# EAGLE design MainBoard 10-11 ver.1 (EAGLE 5.10)
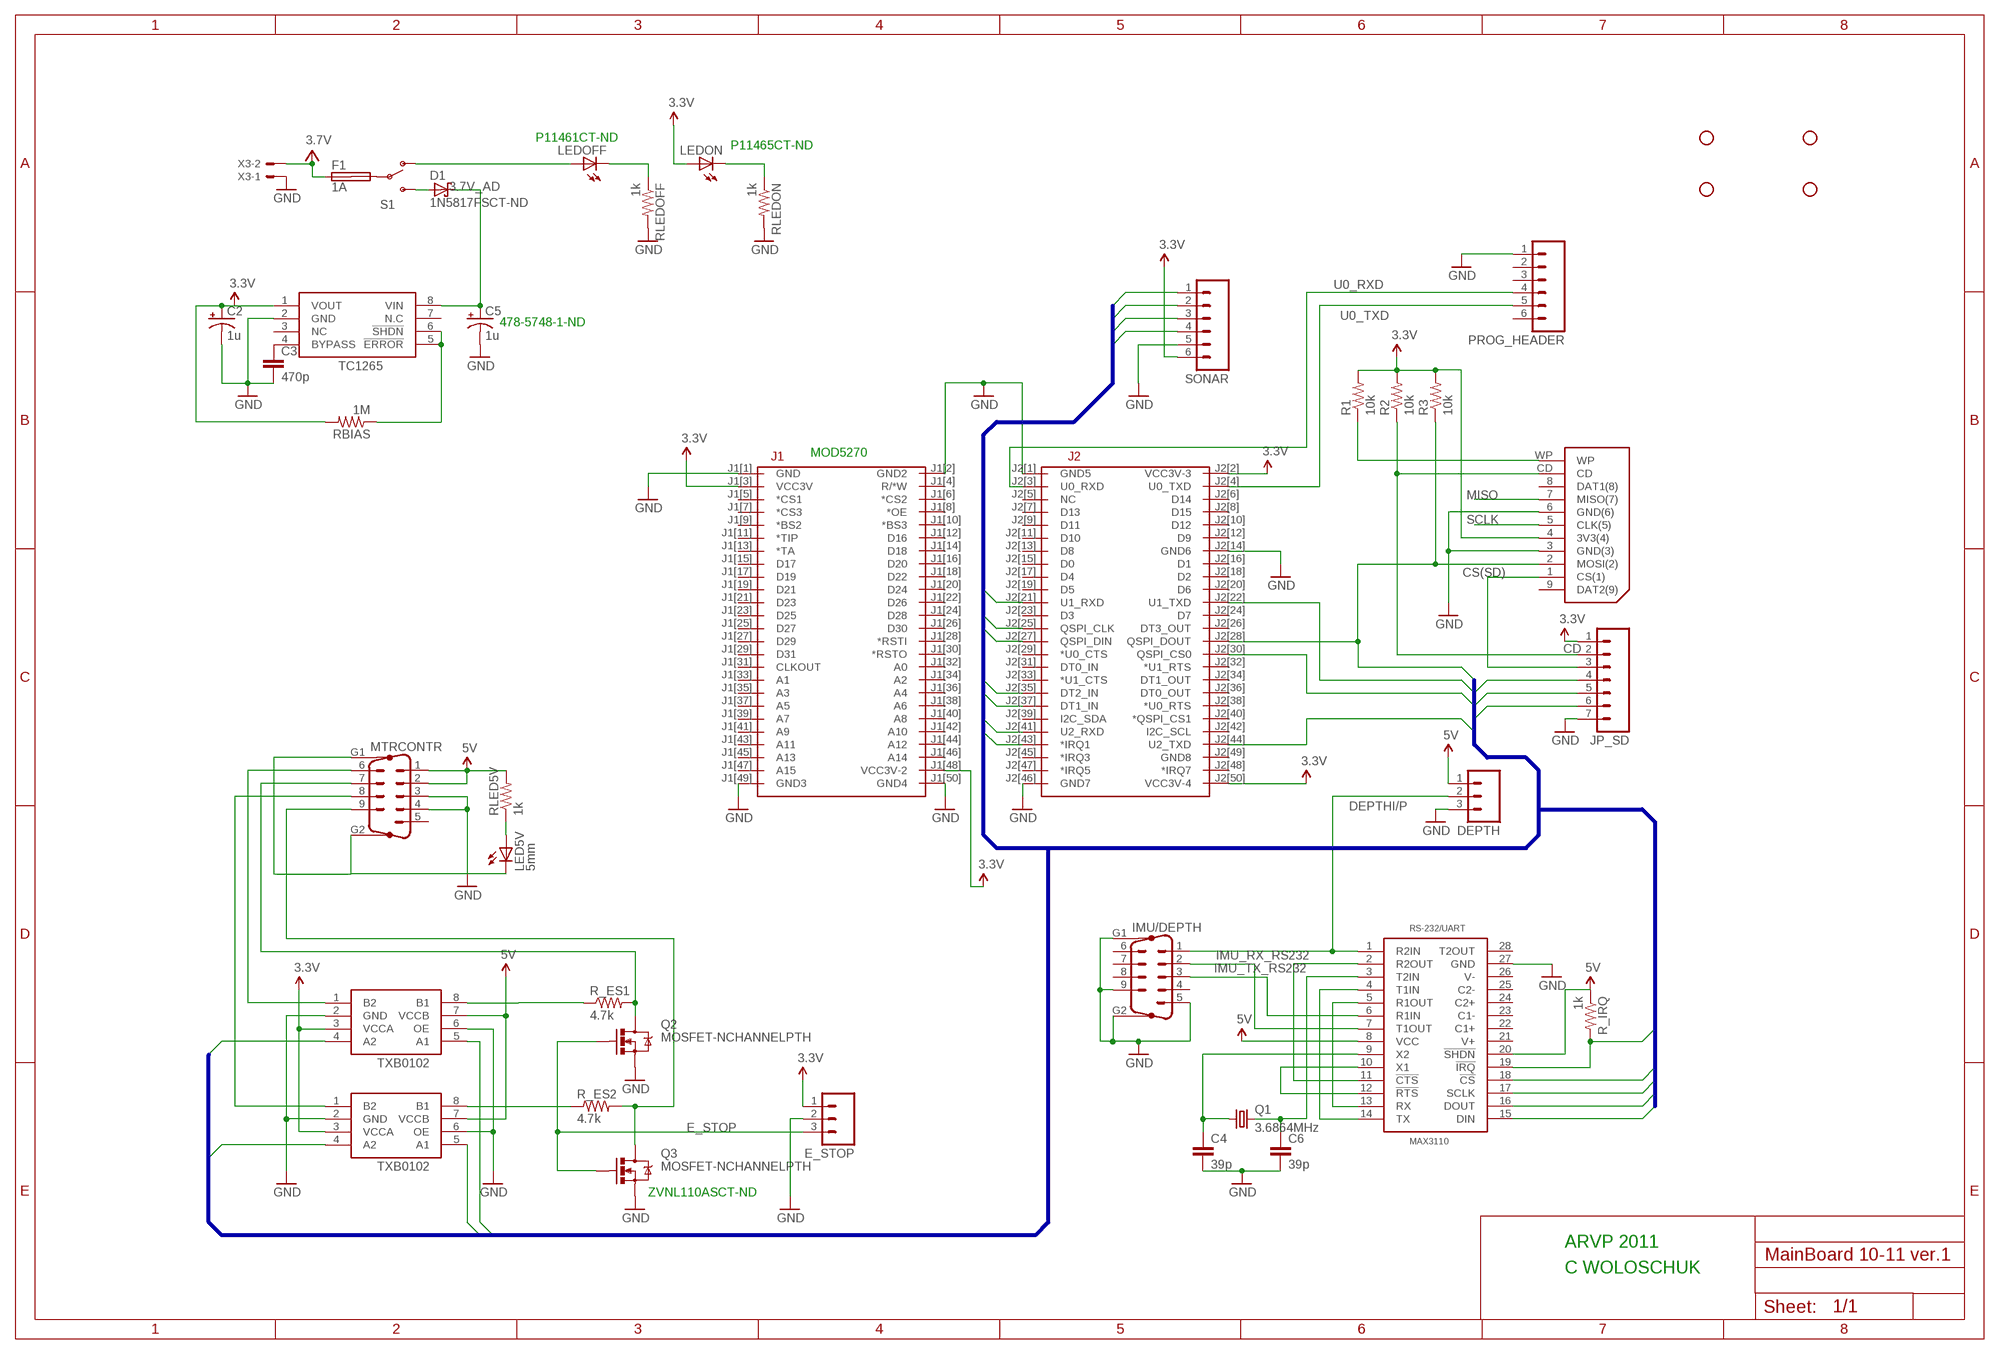
[diagram p0: schematic, sheet 1]

## Parts
C2  1u  CAP_POL1206  [EIA3216]
C3  470p  C-EUC1206  [C1206]
C4  39p  C-EUC1206  [C1206]
C5  1u  CAP_POL1206  [EIA3216]
C6  39p  C-EUC1206  [C1206]
D1  1N5817FSCT-ND  1N5817-B  [DO41-7.6]
DEPTH  M03POLAR  [MOLEX-1X3]
E_STOP  M03POLAR  [MOLEX-1X3]
F1  1A  SHK20L  [SHK20L]
IMU/DEPTH  M09HP  [M09HP]
JP2  STAND-OFF  [STAND-OFF]
JP3  STAND-OFF  [STAND-OFF]
JP4  STAND-OFF  [STAND-OFF]
JP5  STAND-OFF  [STAND-OFF]
JP_SD  M07LOCK  [1X07_LOCK]
LED5V  5mm  LED5MM  [LED5MM]
LEDOFF  LEDCHIP-LED0603  [CHIP-LED0603]
LEDON  LEDCHIP-LED0603  [CHIP-LED0603]
MAX3110  MAX3110  [SO28L]
MOD5270  MOD5270  [MOD5270]
MTRCONTR  M09HP  [M09HP]
PROG_HEADER  M06LOCK_LONGPADS  [1X06_LOCK_LONGPADS]
Q1  3.6864MHz  CRYSTALSM49  [SM49]
Q2  MOSFET-NCHANNELPTH  [TO-92]
Q3  MOSFET-NCHANNELPTH  [TO-92]
R1  10k  RESISTOR1206  [1206]
R2  10k  RESISTOR1206  [1206]
R3  10k  RESISTOR1206  [1206]
R_ES1  4.7k  RESISTOR1206  [1206]
R_ES2  4.7k  RESISTOR1206  [1206]
R_IRQ  1k  RESISTOR1206  [1206]
RBIAS  1M  RESISTOR1206  [1206]
RLED5V  1k  RESISTOR1206  [1206]
RLEDOFF  1k  RESISTOR1206  [1206]
RLEDON  1k  RESISTOR1206  [1206]
S1  SWITCH-SPST  [SWITCH-3PIN-5.47]
SONAR  M06POLAR  [MOLEX-1X6]
TC1265  TC1265  [SO-08]
TXB0101-1  TXB0102  [SOP-08]
TXB0102-2  TXB0102  [SOP-08]
U$2  SD_CARD  [SD_CARD]
X3  KK-156-2  [KK-156-2]

## Nets
3.3V: C2.A(+) E_STOP.1 JP_SD.1 LEDON.A MOD5270.J1[3](VCC3V) MOD5270.J1[48](VCC3V-2) MOD5270.J2[2](VCC3V-3) MOD5270.J2[50](VCC3V-4) R1.2 R2.2 R3.2 RBIAS.2 SONAR.6 TC1265.1(VOUT) TXB0101-1.3(VCCA) TXB0102-2.3(VCCA) U$2.4(3V3(4))
3.7V: F1.1A X3.2
3.7V_AD: C5.A(+) D1.C TC1265.8(VIN)
5V: DEPTH.1 MAX3110.8(VCC) MAX3110.20(!SHDN) MTRCONTR.1 MTRCONTR.2 R_IRQ.1 RLED5V.2 TXB0101-1.7(VCCB) TXB0102-2.7(VCCB)
CD: JP_SD.2 R2.1 U$2.CD
CS(ADC): MOD5270.J2[37](DT1_IN) SONAR.1
CS(MAX3110): MAX3110.18(!CS) MOD5270.J2[30](QSPI_CS0)
CS(SD): JP_SD.3 MOD5270.J2[35](DT2_IN) U$2.1(CS(1))
DEPTHI/P: DEPTH.2 IMU/DEPTH.1 MAX3110.1(R2IN)
E_STOP: E_STOP.3 Q2.3(G) Q3.3(G)
GND: C2.C(-) C3.2 C4.2 C5.C(-) C6.2 DEPTH.3 E_STOP.2 IMU/DEPTH.5 IMU/DEPTH.9 IMU/DEPTH.G1 IMU/DEPTH.G2 JP_SD.7 LED5V.K(C) MAX3110.27(GND) MOD5270.J1[1](GND) MOD5270.J1[2](GND2) MOD5270.J1[49](GND3) MOD5270.J1[50](GND4) MOD5270.J2[1](GND5) MOD5270.J2[14](GND6) MTRCONTR.3 MTRCONTR.4 MTRCONTR.G1 MTRCONTR.G2 PROG_HEADER.1 Q2.2(S) Q3.2(S) RLEDOFF.2 RLEDON.2 SONAR.5 TC1265.2(GND) TXB0101-1.2(GND) TXB0101-1.6(OE) TXB0102-2.2(GND) TXB0102-2.6(OE) U$2.3(GND(3)) U$2.6(GND(6)) X3.1
IMU_RX_RS232: IMU/DEPTH.2 MAX3110.7(T1OUT)
IMU_TX_RS232: IMU/DEPTH.3 MAX3110.6(R1IN)
IRQ1: MAX3110.19(!IRQ) MOD5270.J2[43](*IRQ1) R_IRQ.2
MISO: JP_SD.6 MAX3110.16(DOUT) MOD5270.J2[27](QSPI_DIN) SONAR.3 U$2.7(MISO(7))
MOSI: JP_SD.4 MAX3110.15(DIN) MOD5270.J2[28](QSPI_DOUT) R3.1 SONAR.2 U$2.2(MOSI(2))
N$1: F1.2A S1.P$2(P)
N$2: MAX3110.4(T1IN) MAX3110.14(TX)
N$3: MOD5270.J2[46](GND7) ; supply symbol labelled GND
N$4: R1.1 U$2.WP
N$5: D1.A S1.P$3(S)
N$6: MAX3110.3(T2IN) MAX3110.12(!RTS)
N$7: MAX3110.5(R1OUT) MAX3110.13(RX)
N$8: LEDON.C RLEDON.1
N$9: MAX3110.2(R2OUT) MAX3110.11(!CTS)
N$10: C3.1 TC1265.4(BYPASS)
N$11: LEDOFF.C RLEDOFF.1
N$13: LEDOFF.A S1.P$1(O)
N$14: C6.1 MAX3110.10(X1) Q1.2
N$15: LED5V.A RLED5V.1
N$16: RBIAS.1 TC1265.5(!ERROR) TC1265.6(!SHDN)
N$17: C4.1 MAX3110.9(X2) Q1.1
S1-1: MTRCONTR.6 TXB0101-1.1(B2)
S1-2: MTRCONTR.8 TXB0102-2.1(B2)
S2-1: R_ES1.1 TXB0101-1.8(B1)
S2-1-ES: MTRCONTR.7 Q2.1(D) R_ES1.2
S2-2: R_ES2.1 TXB0102-2.8(B1)
S2-2-ES: MTRCONTR.9 Q3.1(D) R_ES2.2
SCLK: JP_SD.5 MAX3110.17(SCLK) MOD5270.J2[25](QSPI_CLK) SONAR.4 U$2.5(CLK(5))
U0_RXD: MOD5270.J2[3](U0_RXD) PROG_HEADER.4
U0_TXD: MOD5270.J2[4](U0_TXD) PROG_HEADER.5
U1_MCRX: MOD5270.J2[21](U1_RXD) TXB0101-1.5(A1)
U1_MCTX: MOD5270.J2[22](U1_TXD) TXB0101-1.4(A2)
U2_MCRX: MOD5270.J2[41](U2_RXD) TXB0102-2.5(A1)
U2_MCTX: MOD5270.J2[44](U2_TXD) TXB0102-2.4(A2)
Unconnected: F1.1B F1.2B IMU/DEPTH.4 IMU/DEPTH.6 IMU/DEPTH.7 IMU/DEPTH.8 MAX3110.21(V+) MAX3110.22(C1+) MAX3110.23(C1-) MAX3110.24(C2+) MAX3110.25(C2-) MAX3110.26(V-) MAX3110.28(T2OUT) MOD5270.J1[4](R/*W) MOD5270.J1[5](*CS1) MOD5270.J1[6](*CS2) MOD5270.J1[7](*CS3) MOD5270.J1[8](*OE) MOD5270.J1[9](*BS2) MOD5270.J1[10](*BS3) MOD5270.J1[11](*TIP) MOD5270.J1[12](D16) MOD5270.J1[13](*TA) MOD5270.J1[14](D18) MOD5270.J1[15](D17) MOD5270.J1[16](D20) MOD5270.J1[17](D19) MOD5270.J1[18](D22) MOD5270.J1[19](D21) MOD5270.J1[20](D24) MOD5270.J1[21](D23) MOD5270.J1[22](D26) MOD5270.J1[23](D25) MOD5270.J1[24](D28) MOD5270.J1[25](D27) MOD5270.J1[26](D30) MOD5270.J1[27](D29) MOD5270.J1[28](*RSTI) MOD5270.J1[29](D31) MOD5270.J1[30](*RSTO) MOD5270.J1[31](CLKOUT) MOD5270.J1[32](A0) MOD5270.J1[33](A1) MOD5270.J1[34](A2) MOD5270.J1[35](A3) MOD5270.J1[36](A4) MOD5270.J1[37](A5) MOD5270.J1[38](A6) MOD5270.J1[39](A7) MOD5270.J1[40](A8) MOD5270.J1[41](A9) MOD5270.J1[42](A10) MOD5270.J1[43](A11) MOD5270.J1[44](A12) MOD5270.J1[45](A13) MOD5270.J1[46](A14) MOD5270.J1[47](A15) MOD5270.J2[5](NC) MOD5270.J2[6](D14) MOD5270.J2[7](D13) MOD5270.J2[8](D15) MOD5270.J2[9](D11) MOD5270.J2[10](D12) MOD5270.J2[11](D10) MOD5270.J2[12](D9) MOD5270.J2[13](D8) MOD5270.J2[15](D0) MOD5270.J2[16](D1) MOD5270.J2[17](D4) MOD5270.J2[18](D2) MOD5270.J2[19](D5) MOD5270.J2[20](D6) MOD5270.J2[23](D3) MOD5270.J2[24](D7) MOD5270.J2[26](DT3_OUT) MOD5270.J2[29](*U0_CTS) MOD5270.J2[31](DT0_IN) MOD5270.J2[32](*U1_RTS) MOD5270.J2[33](*U1_CTS) MOD5270.J2[34](DT1_OUT) MOD5270.J2[36](DT0_OUT) MOD5270.J2[38](*U0_RTS) MOD5270.J2[39](I2C_SDA) MOD5270.J2[40](*QSPI_CS1) MOD5270.J2[42](I2C_SCL) MOD5270.J2[45](*IRQ3) MOD5270.J2[47](*IRQ5) MOD5270.J2[48](*IRQ7) MOD5270.J2[49](GND8) MTRCONTR.5 PROG_HEADER.2 PROG_HEADER.3 PROG_HEADER.6 TC1265.3(NC) TC1265.7(N.C) U$2.8(DAT1(8)) U$2.9(DAT2(9))

## Buses
U1_MCRX,U2_MCRX,SCLK,MISO,MOSI,CS(SD),CS(ADC),IRQ1,U1_MCTX,U2_MCTX,CS(MAX3110)

## Notes on the sheet
- P11461CT-ND
- P11465CT-ND
- 478-5748-1-ND
- MOD5270
- ZVNL110ASCT-ND
- ARVP 2011
- C WOLOSCHUK

## Library data of the parts
C2 C5 = SparkFun:CAP_POL: Capacitor Polarized These are standard SMD and PTH capacitors. Normally 10uF, 47uF, and 100uF in electrolytic and tantalum varieties. Always verify the external diameter of the through hole cap, it varies with capacity, voltage, and manufacturer. The EIA devices should be standard.
C3 C4 C6 = rcl:C-EU: CAPACITOR, European symbol
D1 = diode:1N581*: 1.0A SCHOTTKY BARRIER RECTIFIER Source: http://www.diodes.com/datasheets/ds23001.pdf
DEPTH E_STOP = SparkFun:M03: Header 3 Standard 3-pin 0.1" header. Use with straight break away headers (SKU : PRT-00116), right angle break away headers (PRT-00553), swiss pins (PRT-00743), machine pins (PRT-00117), and female headers (PRT-00115). Molex polarized connector foot print use with SKU : PRT-08232 with associated crimp pins and housings.
F1 = fuse:SHK20L: FUSE HOLDER 5 x 20 mm, SH contact, SHH1 Schukat, E1073 Buerklin
IMU/DEPTH MTRCONTR = con-subd:M09HP: SUB-D
JP2-JP5 = SparkFun:STAND-OFF: Stand Off This is the mechanical footprint for a #4 phillips button head screw. Use the keepout ring to avoid running the screw head into surrounding components. SKU : PRT-00447
JP_SD = SparkFun:M07: Header 7 Standard 7-pin 0.1" header. Use with straight break away headers (SKU : PRT-00116), right angle break away headers (PRT-00553), swiss pins (PRT-00743), machine pins (PRT-00117), and female headers (PRT-00115). NOTES ON THE VARIANTS LOCK and LOCK_LONGPADS... This footprint was designed to help hold the alignment of a through-hole component (i.e. 7-pin header) while soldering it into place. You may notice that each hole has been shifted either up or down by 0.005 of an inch from it's more standard position (which is usually a perfectly straight line). This slight alteration caused the pins (the squares in the middle) to touch the edges of the holes. Because they are alternating, it causes a "brace" to hold the header in place. 0.005 has proven to be the perfect amount of "off-center" position when using our standard breakaway headers. Although looks a little odd when you look at the bare footprint, once you have a header in there, the alteration is very hard to notice. Also, if you push a header all the way into place, it is covered up entirely on the bottom side. This idea of altering the position of holes to aid alignment will be further integrated into the Sparkfun Library for other footprints. It can help hold any component with 3 or more connection pins.
LED5V = SparkFun:LED: LEDs Standard schematic elements and footprints for 5mm, 3mm, 1206, and 0603 sized LEDs. 5mm - Spark Fun Electronics SKU : COM-00529 (and others)
LEDOFF LEDON = led:LED: LED OSRAM: - CHIPLED LG R971, LG N971, LY N971, LG Q971, LY Q971, LO R971, LY R971 LH N974, LH R974 LS Q976, LO Q976, LY Q976 LO Q996 - Hyper CHIPLED LW Q18S LB Q993, LB Q99A, LB R99A - SideLED LS A670, LO A670, LY A670, LG A670, LP A670 LB A673, LV A673, LT A673, LW A673 LH A674 LY A675 LS A676, LA A676, LO A676, LY A676, LW A676 LS A679, LY A679, LG A679 - Hyper Micro SIDELED® LS Y876, LA Y876, LO Y876, LY Y876 LT Y87S - SmartLED LW L88C, LW L88S LB L89C, LB L89S, LG L890 LS L89K, LO L89K, LY L89K LS L896, LA L896, LO L896, LY L896 - TOPLED LS T670, LO T670, LY T670, LG T670, LP T670 LSG T670, LSP T670, LSY T670, LOP T670, LYG T670 LG T671, LOG T671, LSG T671 LB T673, LV T673, LT T673, LW T673 LH T674 LS T676, LA T676, LO T676, LY T676, LB T676, LH T676, LSB T676, LW T676 LB T67C, LV T67C, LT T67C, LS T67K, LO T67K, LY T67K, LW E67C LS E67B, LA E67B, LO E67B, LY E67B, LB E67C, LV E67C, LT E67C LW T67C LS T679, LY T679, LG T679 LS T770, LO T770, LY T770, LG T770, LP T770 LB T773, LV T773, LT T773, LW T773 LH T774 LS E675, LA E675, LY E675, LS T675 LS T776, LA T776, LO T776, LY T776, LB T776 LHGB T686 LT T68C, LB T68C - Hyper Mini TOPLED® LB M676 - Mini TOPLED Santana® LG M470 LS M47K, LO M47K, LY M47K Source: http://www.osram.convergy.de LUXEON: - LUMILED® LXK2-PW12-R00, LXK2-PW12-S00, LXK2-PW14-U00, LXK2-PW14-V00 LXK2-PM12-R00, LXK2-PM12-S00, LXK2-PM14-U00 LXK2-PE12-Q00, LXK2-PE12-R00, LXK2-PE12-S00, LXK2-PE14-T00, LXK2-PE14-U00 LXK2-PB12-K00, LXK2-PB12-L00, LXK2-PB12-M00, LXK2-PB14-N00, LXK2-PB14-P00, LXK2-PB14-Q00 LXK2-PR12-L00, LXK2-PR12-M00, LXK2-PR14-Q00, LXK2-PR14-R00 LXK2-PD12-Q00, LXK2-PD12-R00, LXK2-PD12-S00 LXK2-PH12-R00, LXK2-PH12-S00 LXK2-PL12-P00, LXK2-PL12-Q00, LXK2-PL12-R00 Source: www.luxeon.com KINGBRIGHT: KA-3528ASYC Source: www.kingbright.com
MAX3110 = ARVP:MAX3110
MOD5270 = ARVP:MOD5270: Coldfire MOD5270 Microcontroller footprint
PROG_HEADER SONAR = SparkFun:M06: Header 6 Standard 6-pin 0.1" header. Use with straight break away headers (SKU : PRT-00116), right angle break away headers (PRT-00553), swiss pins (PRT-00743), machine pins (PRT-00117), and female headers (PRT-00115). Molex polarized connector foot print use with SKU : PRT-08094 with associated crimp pins and housings. NOTES ON THE VARIANTS LOCK and LOCK_LONGPADS... This footprint was designed to help hold the alignment of a through-hole component (i.e. 6-pin header) while soldering it into place. You may notice that each hole has been shifted either up or down by 0.005 of an inch from it's more standard position (which is a perfectly straight line). This slight alteration caused the pins (the squares in the middle) to touch the edges of the holes. Because they are alternating, it causes a "brace" to hold the component in place. 0.005 has proven to be the perfect amount of "off-center" position when using our standard breakaway headers. Although looks a little odd when you look at the bare footprint, once you have a header in there, the alteration is very hard to notice. Also, if you push a header all the way into place, it is covered up entirely on the bottom side. This idea of altering the position of holes to aid alignment will be further integrated into the Sparkfun Library for other footprints. It can help hold any component with 3 or more connection pins.
Q1 = crystal:CRYSTAL: CRYSTAL
Q2 Q3 = SparkFun:MOSFET-NCHANNEL
R1-R3 R_ES1 R_ES2 R_IRQ RBIAS RLED5V RLEDOFF RLEDON = SparkFun:RESISTOR: Resistor Basic schematic elements and footprints for 0603, 1206, and PTH 1/10th watt (small) resistors.
S1 = ARVP:SWITCH-SPST: SPST Switch Simple slide switch. Spark Fun Electronics SKU : COM-00102
TC1265 = ARVP:TC1265
TXB0101-1 TXB0102-2 = ARVP:TXB0102
U$2 = ARVP:SD_CARD
X3 = con-molex:KK-156-2: KK 156 HEADER Source: http://www.molex.com/pdm_docs/sd/026604100_sd.pdf

## Board
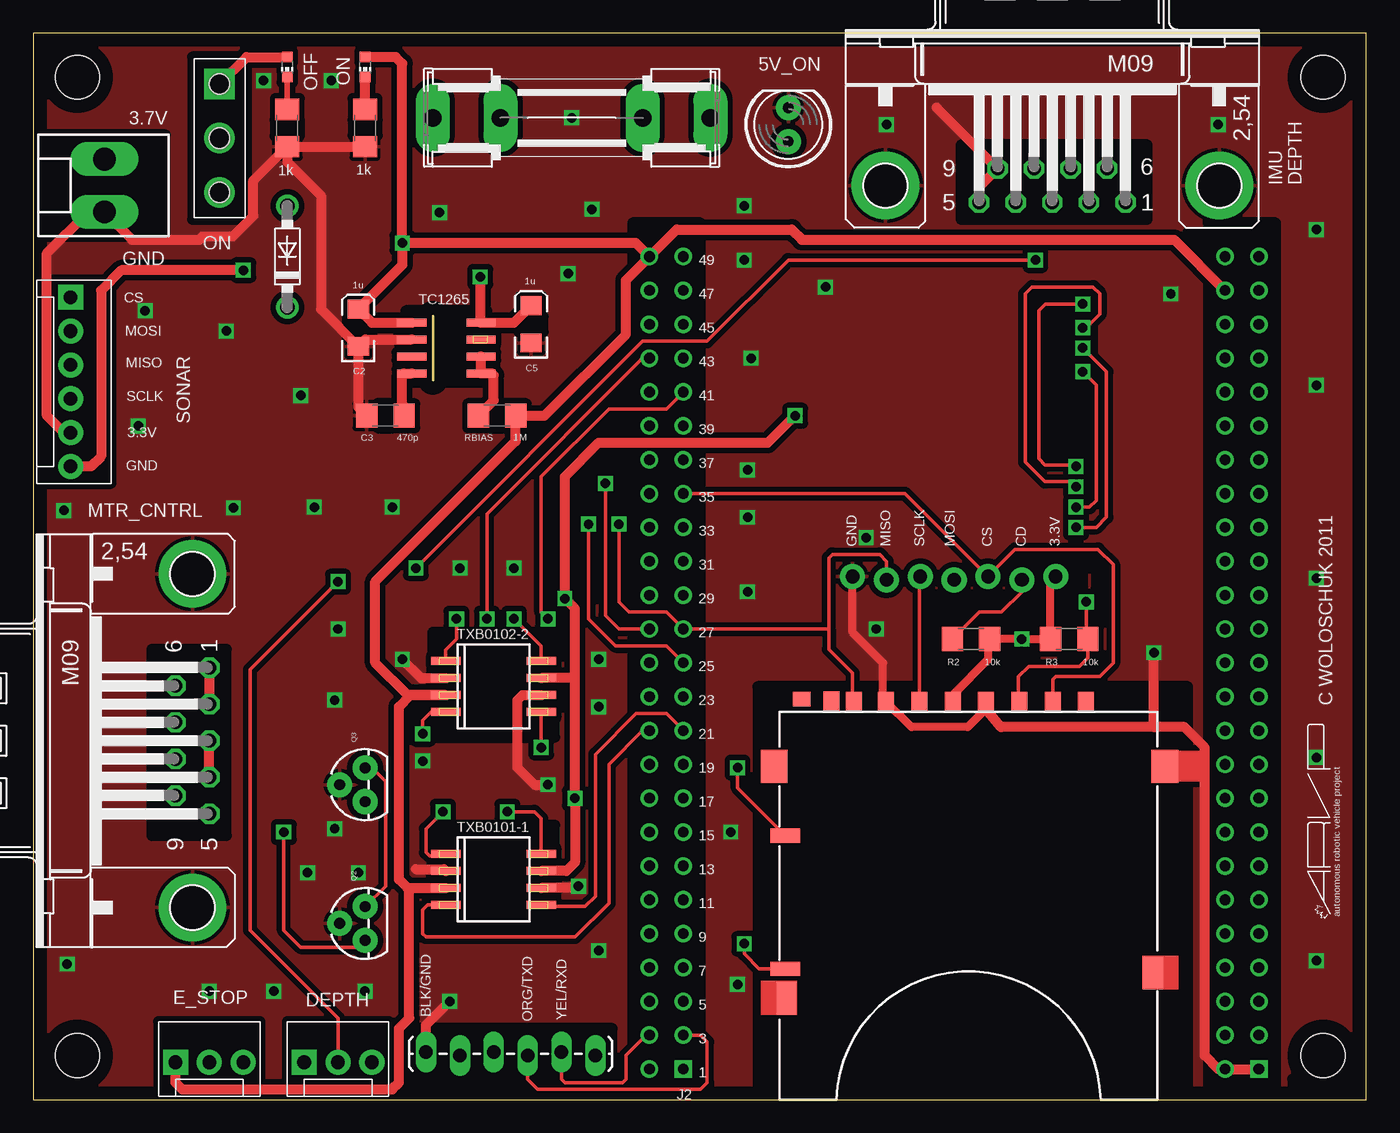
[diagram p1: board, top side]
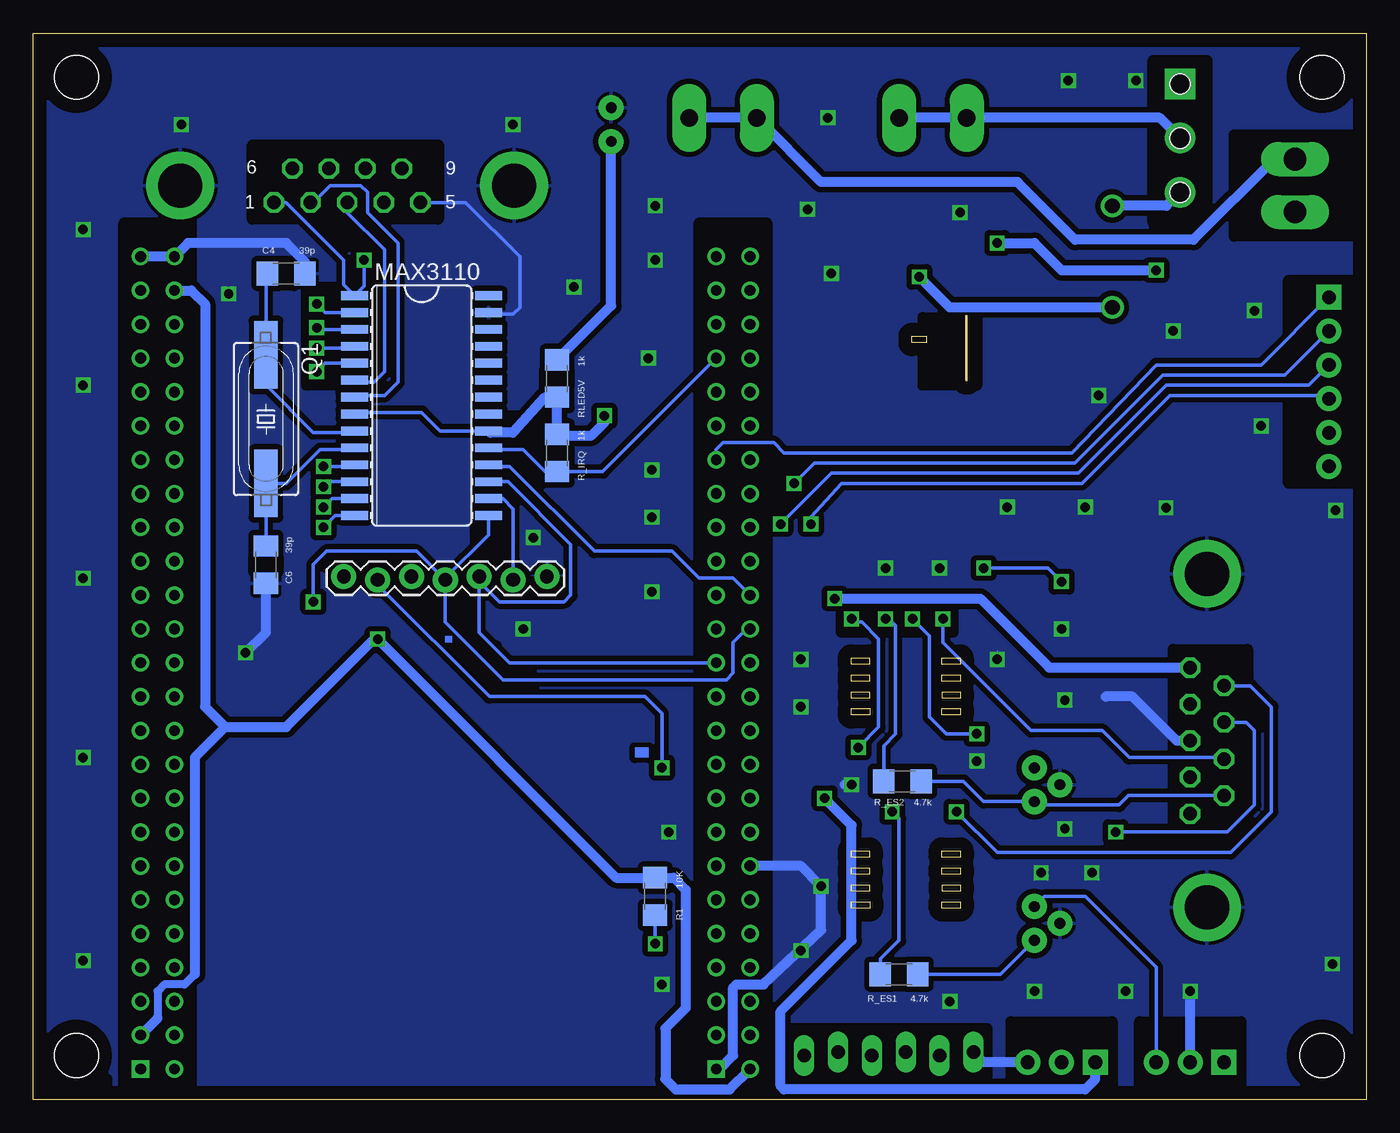
[diagram p2: board, bottom side, seen from below]

Size 100 x 80 mm. Coordinates in mm from the lower left corner, seen from the top.
Outline: 0,0 100,0 100,80 0,80 0,0
Copper layers (1*16): Top 0.035mm / dielectric 1.5mm / Bottom 0.035mm
Design rules "default *": minimum track width 10mil, minimum drill 28mil, track to track 8mil, track to pad 8mil, pad to pad 8mil, via to via 8mil, smd to smd 8mil, copper to edge 40mil, drill to drill 8mil, minimum pad ring 10mil, minimum via ring 8mil, stop-mask expansion 4mil, vias tented up to drill 28mil, thermal gap 10mil
tRestrict: area 30,12.7 to 39.1,20.6; area 30,27.2 to 39.1,35.1; area 0.3,46.2 to 5.8,61.5; area 9.4,0.3 to 17,5.8; area 19,0.3 to 26.7,5.8; area 28.7,1.8 to 43.4,5.3; area 11.9,66 to 16,78.2; area 0,64.8 to 9.9,72.4; area 69.6,66 to 83.6,71.6; area 8.9,19.8 to 14.5,33.8; area 45,0 to 50,65.8; area 88.1,0 to 93.2,65.8; 50 more areas
bRestrict: area 0.3,46.2 to 5.8,61.5; area 9.4,0.3 to 17,5.8; area 19,0.3 to 26.7,5.8; area 28.4,1.8 to 43.2,5.3; area 11.9,65.8 to 16,78; area 0,64.8 to 9.9,72.4; area 69.6,66 to 83.6,71.6; area 8.9,19.8 to 14.5,33.8; area 45,0 to 50,65.8; area 88.1,0 to 93.2,65.8; area 61.7,46.2 to 64.3,51.3; area 5.8,54.1 to 7.1,55.6; 33 more areas

### Footprints (pad centres in the part's own frame; a part is rotated, then mirrored left to right if it is on the bottom)
EIA3216 = smd 1.4 x 1.6: A 1.4,0; C -1.4,0
C1206 = smd 1.6 x 1.8: 1 -1.4,0; 2 1.4,0
DO41-7.6 = drill 1.1 pad 1.7 round: A 3.81,0; C -3.81,0
MOLEX-1X3 = drill 1.016 pad 1.88 square: 1 0,0 | drill 1.016 pad 1.88 round: 2 2.54,0; 3 5.08,0
SHK20L = drill 1.321 pad 2.54 long: 1A -10.414,0; 1B -5.334,0; 2A 10.414,0; 2B 5.334,0
M09HP = drill 1.016 octagon: 1 -5.486,1.27; 2 -2.743,1.27; 3 0,1.27; 4 2.743,1.27; 5 5.486,1.27; 6 -4.115,-1.27; 7 -1.372,-1.27; 8 1.372,-1.27; 9 4.115,-1.27 | drill 3.302 pad 5.08 round: G1 -12.522,0; G2 12.522,0
STAND-OFF = hole 3.302: 0,0
1X07_LOCK = drill 1.016 pad 1.88 round: 1 0,0.127; 2 2.54,-0.127; 3 5.08,0.127; 4 7.62,-0.127; 5 10.16,0.127; 6 12.7,-0.127; 7 15.24,0.127
LED5MM = drill 0.813 pad 1.88 round: A -1.27,0; K 1.27,0
CHIP-LED0603 = smd 0.8 x 0.8: A 0,-0.75; C 0,0.75
SO28L = smd 0.66 x 2.032: 1 -8.255,-5.029; 2 -6.985,-5.029; 3 -5.715,-5.029; 4 -4.445,-5.029; 5 -3.175,-5.029; 6 -1.905,-5.029; 7 -0.635,-5.029; 8 0.635,-5.029; 9 1.905,-5.029; 10 3.175,-5.029; 11 4.445,-5.029; 12 5.715,-5.029; 13 6.985,-5.029; 14 8.255,-5.029; 15 8.255,5.029; 16 6.985,5.029; 17 5.715,5.029; 18 4.445,5.029; 19 3.175,5.029; 20 1.905,5.029; 21 0.635,5.029; 22 -0.635,5.029; 23 -1.905,5.029; 24 -3.175,5.029; 25 -4.445,5.029; 26 -5.715,5.029; 27 -6.985,5.029; 28 -8.255,5.029
MOD5270 = drill 0.8 square: J1[1] -23.368,35.052; J2[1] 19.812,35.052 | drill 0.8 round: J1[2] -20.828,35.052; J1[3] -23.368,32.512; J1[4] -20.828,32.512; J1[5] -23.368,29.972; J1[6] -20.828,29.972; J1[7] -23.368,27.432; J1[8] -20.828,27.432; J1[9] -23.368,24.892; J1[10] -20.828,24.892; J1[11] -23.368,22.352; J1[12] -20.828,22.352; J1[13] -23.368,19.812; J1[14] -20.828,19.812; J1[15] -23.368,17.272; J1[16] -20.828,17.272; J1[17] -23.368,14.732; J1[18] -20.828,14.732; J1[19] -23.368,12.192; J1[20] -20.828,12.192; J1[21] -23.368,9.652; J1[22] -20.828,9.652; J1[23] -23.368,7.112; J1[24] -20.828,7.112; J1[25] -23.368,4.572; J1[26] -20.828,4.572; J1[27] -23.368,2.032; J1[28] -20.828,2.032; J1[29] -23.368,-0.508; J1[30] -20.828,-0.508; J1[31] -23.368,-3.048; J1[32] -20.828,-3.048; J1[33] -23.368,-5.588; J1[34] -20.828,-5.588; J1[35] -23.368,-8.128; J1[36] -20.828,-8.128; J1[37] -23.368,-10.668; J1[38] -20.828,-10.668; J1[39] -23.368,-13.208; J1[40] -20.828,-13.208; J1[41] -23.368,-15.748; J1[42] -20.828,-15.748; J1[43] -23.368,-18.288; J1[44] -20.828,-18.288; J1[45] -23.368,-20.828; J1[46] -20.828,-20.828; J1[47] -23.368,-23.368; J1[48] -20.828,-23.368; J1[49] -23.368,-25.908; J1[50] -20.828,-25.908; J2[2] 22.352,35.052; J2[3] 19.812,32.512; J2[4] 22.352,32.512; J2[5] 19.812,29.972; J2[6] 22.352,29.972; J2[7] 19.812,27.432; J2[8] 22.352,27.432; J2[9] 19.812,24.892; J2[10] 22.352,24.892; J2[11] 19.812,22.352; J2[12] 22.352,22.352; J2[13] 19.812,19.812; J2[14] 22.352,19.812; J2[15] 19.812,17.272; J2[16] 22.352,17.272; J2[17] 19.812,14.732; J2[18] 22.352,14.732; J2[19] 19.812,12.192; J2[20] 22.352,12.192; J2[21] 19.812,9.652; J2[22] 22.352,9.652; J2[23] 19.812,7.112; J2[24] 22.352,7.112; J2[25] 19.812,4.572; J2[26] 22.352,4.572; J2[27] 19.812,2.032; J2[28] 22.352,2.032; J2[29] 19.812,-0.508; J2[30] 22.352,-0.508; J2[31] 19.812,-3.048; J2[32] 22.352,-3.048; J2[33] 19.812,-5.588; J2[34] 22.352,-5.588; J2[35] 19.812,-8.128; J2[36] 22.352,-8.128; J2[37] 19.812,-10.668; J2[38] 22.352,-10.668; J2[39] 19.812,-13.208; J2[40] 22.352,-13.208; J2[41] 19.812,-15.748; J2[42] 22.352,-15.748; J2[43] 19.812,-18.288; J2[44] 22.352,-18.288; J2[45] 19.812,-20.828; J2[46] 22.352,-20.828; J2[47] 19.812,-23.368; J2[48] 22.352,-23.368; J2[49] 19.812,-25.908; J2[50] 22.352,-25.908
1X06_LOCK_LONGPADS = drill 1.016 long: 1 0,0; 2 2.54,-0.254; 3 5.08,0; 4 7.62,-0.254; 5 10.16,0; 6 12.7,-0.254
SM49 = smd 5.08 x 1.778: 1 -4.826,0; 2 4.826,0
TO-92 = drill 0.813 pad 1.88 round: 1 -1.27,0; 2 0,1.905; 3 1.27,0
1206 = smd 1.6 x 1.8: 1 -1.4,0; 2 1.4,0
SWITCH-3PIN-5.47 = drill 1.524 square: P$1 0,0 | drill 1.524 round: P$2 0,-4.064; P$3 0,-8.128 | hole 1.524: 0,0; 0,-4.064; 0,-8.128
MOLEX-1X6 = drill 1.016 pad 1.88 square: 1 0,0 | drill 1.016 pad 1.88 round: 2 2.54,0; 3 5.08,0; 4 7.62,0; 5 10.16,0; 6 12.7,0
SO-08 = smd 0.6 x 2.2: 1 -1.905,-2.6; 2 -0.635,-2.6; 3 0.635,-2.6; 4 1.905,-2.6; 5 1.905,2.6; 6 0.635,2.6; 7 -0.635,2.6; 8 -1.905,2.6
SOP-08 = smd 0.6 x 2.2: 1 -1.905,-3.6; 2 -0.635,-3.6; 3 0.635,-3.6; 4 1.905,-3.6; 5 1.905,3.575; 6 0.635,3.575; 7 -0.635,3.575; 8 -1.905,3.575
SD_CARD = smd 1.2 x 1.5: 1 6.88,12.07; 2 4.38,12.07; 3 1.88,12.07; 4 -0.62,12.07; 5 -3.12,12.07; 6 -5.62,12.07; 7 -8.04,12.07; 8 -9.728,12.09; 9 9.38,12.07 | smd 1.5 x 2.5: 12 -13.1,-10.18; 13 14.402,-8.255 | smd 2 x 2.5: 14 -14,7.22; 15 15.3,7.22 | smd 2.184 x 1.067: CD -13.18,2.02; WP -13.18,-7.98 | smd 1.3 x 1.1: SW -11.938,12.268
KK-156-2 = drill 1.7 pad 2.184 long: 1 -1.98,0; 2 1.98,0

### Placement (x,y rotation side)
C2  24.38,57.91 90 top
C3  26.42,51.31 180 top
C4  81.03,61.98 0 bottom
C5  37.34,58.17 90 top
C6  82.55,40.13 270 bottom
D1  19.05,63.25 90 top
DEPTH  20.32,2.79 0 top
E_STOP  10.67,2.79 0 top
F1  40.39,73.66 180 top
IMU/DEPTH  76.45,68.58 180 top
JP2  96.77,76.71 0 top
JP3  3.3,76.71 0 top
JP4  3.3,3.3 0 top
JP5  96.77,3.3 0 top
JP_SD  76.71,39.12 0 bottom
LED5V  56.64,73.15 90 top
LEDOFF  19.05,77.47 180 top
LEDON  24.89,77.47 180 top
MAX3110  70.87,52.07 270 bottom
MOD5270  68.58,37.34 180 top
MTRCONTR  11.94,26.92 270 top
PROG_HEADER  29.46,3.56 0 top
Q1  82.55,51.05 270 bottom
Q2  24.89,13.21 90 top
Q3  24.89,23.62 90 top
R1  53.34,15.24 90 bottom
R2  70.36,34.54 0 top
R3  77.72,34.54 180 top
R_ES1  35.05,9.4 0 bottom
R_ES2  34.8,23.88 0 bottom
R_IRQ  60.71,48.51 270 bottom
RBIAS  34.8,51.31 0 top
RLED5V  60.71,54.1 270 bottom
RLEDOFF  19.05,72.9 270 top
RLEDON  24.89,72.9 270 top
S1  13.97,76.2 0 top
SONAR  2.79,60.2 270 top
TC1265  30.99,56.39 270 top
TXB0101-1  34.54,16.51 270 top
TXB0102-2  34.54,30.99 270 top
U$1  [ARVP]  98.04,13.72 90 top
U$2  69.6,17.78 0 top
X3  5.33,68.58 90 top

### Tracks (layer width: path | path; a pad name or v marks a point on that pad's centre or on a via)
3.3V  (via drill 0.71)
  Top 0.254: 68.98,30.37 U$2.4 | R2.2 71.63,34.41
  Top 0.61: 76.32,38.86 R3.2 v74.17,34.54 R2.2 | 68.98,30.37 71.63,33.02 71.63,34.41
  Top 0.762: TC1265.1 25.4,58.29 C2.A 27.69,62.61 v27.69,64.26 | v15.75,62.23 6.6,62.23 5.08,60.71 5.08,48.26 4.32,47.5 SONAR.6 | LEDON.A 27.19,78.22 27.69,77.72 v27.69,64.26 | 76.32,38.86 JP_SD.1 | v27.69,64.26 45.21,64.26 MOD5270.J2[50] | 28.07,15.88 27.43,16.51 27.43,29.46 28.32,30.35 TXB0102-2.3 28.07,30.35 25.65,32.77 25.65,38.86 36.2,49.41 RBIAS.2 38.35,51.31 44.45,57.4 44.45,61.47 MOD5270.J2[50] | 28.07,15.88 TXB0101-1.3 | 28.07,15.88 28.19,15.75 28.19,6.1 27.43,5.33 27.43,1.27 26.92,0.76 11.18,0.76 10.67,1.27 E_STOP.1 | MOD5270.J2[50] 48.26,65.28 56.9,65.28 57.66,64.52 85.6,64.52 MOD5270.J1[48]
  Bottom 0.61: 90.68,6.1 90.68,8.13 90.17,8.64 88.65,8.64 87.88,9.4
  Bottom 0.762: v15.75,62.23 22.86,62.23 24.89,64.26 v27.69,64.26 | 90.68,6.1 MOD5270.J1[3] | 87.88,9.4 87.88,25.65 85.6,27.94 | 85.6,27.94 81.03,27.94 74.42,34.54 v74.17,34.54 56.26,16.64 R1.2 51.95,16.64 51.05,15.75 51.05,6.86 52.58,5.33 52.58,1.52 51.82,0.76 47.75,0.76 MOD5270.J2[2] | 85.6,27.94 87.12,29.46 87.12,59.69 88.14,60.71 MOD5270.J1[48]
3.7V
  Bottom 0.762: X3.2 6.91,70.56 12.95,64.52 21.84,64.52 26.16,68.83 40.89,68.83 45.72,73.66 F1.1A
3.7V_AD  (via drill 0.71)
  Top 0.762: v33.53,61.72 33.53,58.35 TC1265.8 36.06,58.29 C5.A
  Bottom 0.762: D1.C 31.24,59.44 v33.53,61.72
5V  (via drill 0.71)
  Top 0.762: v57.15,51.31 55.12,49.28 42.42,49.28 39.88,46.74 v39.88,37.59 40.64,36.83 40.64,31.75 | MTRCONTR.1 MTRCONTR.2 | TXB0102-2.7 40.51,31.62 40.64,31.75 | TXB0101-1.7 40.01,17.14 40.64,17.78 v40.64,22.61 40.64,31.75
  Bottom 0.254: RLED5V.2 61.6,52.7 | 65.71,50.04 MAX3110.20 69.47,50.16 70.87,51.56 75.77,51.56 MAX3110.8
  Bottom 0.762: 61.6,52.7 64.01,50.04 65.71,50.04 | RLED5V.2 R_IRQ.1 60.58,49.78 58.17,49.78 57.15,50.8 v57.15,51.31 | MTRCONTR.1 23.77,32.41 28.96,37.59 v39.88,37.59 | v40.64,22.61 38.61,20.57 38.61,11.94 43.94,6.6 43.94,1.02 43.69,0.76 21.08,0.76 20.32,1.52 DEPTH.1
CD  (via drill 0.71)
  Top 0.254: JP_SD.2 74.17,38.1 72.64,36.58 70.99,36.58 R2.1 | U$2.CD 52.83,23.38 v52.83,24.89
  Bottom 0.254: v52.83,24.89 52.83,28.96 54.1,30.23 65.79,30.23 74.17,38.61 JP_SD.2
CS(ADC)
  Bottom 0.254: SONAR.1 7.87,55.12 15.75,55.12 22.1,48.51 43.69,48.51 44.45,49.28 48.26,49.28 48.77,48.77 MOD5270.J2[37]
CS(MAX3110)
  Bottom 0.254: MOD5270.J2[30] 47.5,39.12 50.04,39.12 52.07,41.15 57.91,41.15 64.26,47.5 65.71,47.5 MAX3110.18
CS(SD)
  Top 0.254: MOD5270.J2[35] 65.41,45.47 JP_SD.3 73.66,41.27 79.88,41.27 81.03,40.13 81.03,32.77 80.01,31.75 76.71,31.75 76.48,31.52 U$2.1
DEPTHI/P  (via drill 0.71)
  Top 0.254: v75.18,62.99 56.64,62.99 50.55,56.9 45.72,56.9 v28.7,39.88 | v22.86,38.86 16.26,32.26 16.26,12.7 22.86,6.1 DEPTH.2
  Bottom 0.254: IMU/DEPTH.1 81.03,67.31 76.71,62.99 76.71,61.14 MAX3110.1 75.18,61.04 v75.18,62.99 | v28.7,39.88 23.88,39.88 v22.86,38.86
E_STOP
  Top 0.254: Q3.3 25.4,24.89 26.42,23.88 26.42,16 Q2.3
  Bottom 0.254: Q2.3 24.13,15.24 21.08,15.24 15.75,9.91 E_STOP.3
GND  (via drill 0.71)
  Top 0.254: U$2.6 63.75,30.07
  Top 0.406: C2.C 24.89,57.02
  Top 0.61: JP_SD.7 61.47,35.05 63.75,32.77 63.75,30.07 | U$2.3 71.48,29.31 70.1,27.94 65.89,27.94 U$2.6
  Top 0.762: RLEDOFF.2 RLEDON.2 | RLEDOFF.2 16.51,68.96 16.51,66.29 14.99,64.77 12.7,64.77 12.45,64.52 7.42,64.52 X3.1 4.12,66.6 1.02,63.5 1.02,51.31 2.29,50.04 SONAR.5 | 24.89,57.02 TC1265.2 | RLEDOFF.2 19.05,70.36 21.59,67.82 21.59,59.31 C2.C 24.38,51.94 C3.2 | IMU/DEPTH.5 70.97,68.48 IMU/DEPTH.9 67.77,74.42 | TXB0102-2.2 29.08,31.62 v27.69,33.02 | 71.48,29.31 72.59,27.94 84.07,27.94 84.2,28.07 | v84.07,33.53 84.07,28.19 84.2,28.07 | 84.2,28.07 84.33,27.94 86.36,27.94 87.88,26.42 87.88,3.3 88.9,2.29 MOD5270.J1[2] MOD5270.J1[1] | TXB0102-2.6 36.7,30.35 36.32,29.97 36.32,24.89 37.59,23.62 v38.61,23.62 | TXB0101-1.6 40.77,15.88 v40.89,16 | TXB0101-1.2 30.82,17.27 28.7,17.27 | MTRCONTR.4 MTRCONTR.3 | PROG_HEADER.1 29.46,5.59 v31.24,7.37
  Bottom 0.254: IMU/DEPTH.5 67.56,67.31 63.5,63.25 63.5,59.44 64.01,58.93 65.71,58.93 MAX3110.27 | C4.2 79.63,62.86 | 22.43,24.18 Q3.2 | v27.69,33.02 27.69,33.53
  Bottom 0.762: 79.63,62.86 81.03,64.26 88.39,64.26 MOD5270.J1[50] MOD5270.J1[49] | C6.2 82.55,35.05 v84.07,33.53 | v38.61,23.62 39.12,23.62 | DEPTH.3 28.7,2.79 PROG_HEADER.1 | MOD5270.J2[1] 48.51,2.29 47.5,3.3 47.5,8.38 47.24,8.64 45.21,8.64 40.89,12.7 v40.89,16 42.42,17.53 MOD5270.J2[14] | MTRCONTR.3 14.22,26.92 17.53,30.23 19.56,30.23 | E_STOP.2 v13.21,8.13
  other vias: 53.59,38.1 8.38,59.18 14.48,57.66 29.21,25.4 42.42,33.02 42.42,29.46 22.61,29.97 24.38,17.02 20.57,17.02 22.61,20.32 2.54,10.16 18.03,8.13 24.89,8.13 42.42,11.18 7.87,50.55 20.07,52.83 2.29,44.2 15.01,44.4 26.92,44.45 30.48,66.55 41.91,66.8 53.34,67.06 53.34,62.99 53.85,55.63 59.44,60.96 53.59,43.69 53.59,47.24 96.27,10.41 96.27,25.65 96.27,39.12 96.27,53.59 96.27,65.28 85.34,60.45 64.01,73.15 88.9,73.15 40.39,73.66 40.13,61.98 63.25,35.31 32,39.88 36.07,39.88 22.86,35.31 62.48,42.16 21.08,44.45 22.35,76.45 17.27,76.45 52.83,8.64 52.32,20.07
  pour Top (isolate 0.406): 0,80.01 100.08,80.01 100.08,0 0,0
  pour Bottom (isolate 0.406): 0,80.01 100.08,80.01 100.08,0 0,0
IMU_RX_RS232
  Bottom 0.254: IMU/DEPTH.2 79.2,67.26 79.05,67.26 77.72,68.58 75.44,68.58 74.93,68.07 74.93,66.55 72.64,64.26 72.64,53.85 73.66,52.83 75.77,52.83 MAX3110.7
IMU_TX_RS232
  Bottom 0.254: IMU/DEPTH.3 76.45,66.55 73.66,63.75 73.66,54.61 74.42,53.85 75.77,53.85 MAX3110.6
IRQ1
  Bottom 0.254: MAX3110.19 65.71,48.77 63.25,48.77 61.59,47.11 R_IRQ.2 57.28,47.11 MOD5270.J2[43]
MISO  (via drill 0.71)
  Top 0.254: JP_SD.6 64.01,40.39 63.5,40.89 59.94,40.89 59.69,40.64 59.69,35.31 | 59.69,35.31 59.69,33.78 61.47,32 61.47,29.94 U$2.7 | 59.69,35.31 MOD5270.J2[27] 47.5,36.58 44.7,36.58 43.94,37.34 v43.94,43.18
  Bottom 0.254: SONAR.3 4.32,53.59 14.99,53.59 21.59,46.99 40.13,46.99 v43.94,43.18 | MAX3110.16 64.77,45.09 64.01,44.32 JP_SD.6
MOSI  (via drill 0.71)
  Top 0.254: U$2.2 73.91,29.91 73.91,31.75 74.68,32.51 78.49,32.51 79.12,33.15 R3.1 78.99,34.67 v78.99,37.34 | v42.93,46.23 42.93,36.32 43.94,35.31 MOD5270.J2[28]
  Bottom 0.254: SONAR.2 6.1,54.36 15.24,54.36 21.84,47.75 41.4,47.75 v42.93,46.23 | JP_SD.4 69.09,37.59 | MOD5270.J2[28] 46.48,35.31 47.5,34.29 47.5,32 48.01,31.5 64.77,31.5 69.09,35.81 JP_SD.4 | v78.99,37.34 78.99,40.13 77.98,41.15 71.25,41.15 JP_SD.4 | JP_SD.4 69.09,39.12 65.84,42.37 MAX3110.15
N$1
  Bottom 0.762: S1.P$2 15.49,73.66 F1.2A 35.31,73.66
N$2  (via drill 0.71)
  Top 0.254: v78.74,56.39 80.52,54.61 80.52,43.69 79.76,42.93 v78.23,42.93
  Bottom 0.254: MAX3110.4 76.02,56.39 v78.74,56.39 | v78.23,42.93 77.34,43.81 MAX3110.14
N$4  (via drill 0.71)
  Top 0.254: U$2.WP 54.46,9.8 53.34,10.92 v53.34,11.68
  Bottom 0.254: v53.34,11.68 R1.1
N$5
  Bottom 0.762: S1.P$3 14.99,67.06 D1.A
N$6  (via drill 0.71)
  Top 0.254: v78.74,57.91 78.99,57.91 80.01,58.93 80.01,60.45 79.5,60.96 74.93,60.96 74.42,60.45 74.42,47.83 MAX3110.12 77.85,46.35 v78.23,45.97
  Bottom 0.254: MAX3110.3 78.61,57.78 v78.74,57.91 | v78.23,45.97 77.85,46.35 MAX3110.12
N$7  (via drill 0.71)
  Top 0.254: v78.23,44.45 79.25,44.45 79.76,44.96 79.76,53.59 v78.74,54.61
  Bottom 0.254: v78.74,54.61 78.11,55.24 MAX3110.5 | MAX3110.13 77.6,45.09 v78.23,44.45
N$8
  Top 0.762: RLEDON.1 LEDON.C
N$9  (via drill 0.71)
  Top 0.254: v78.74,59.69 75.95,59.69 75.44,59.18 75.44,48.08 MAX3110.11 78.11,47.62 v78.23,47.5
  Bottom 0.254: MAX3110.2 78.11,59.05 v78.74,59.69 | v78.23,47.5 76.02,47.5 MAX3110.11
N$10
  Top 0.762: C3.1 27.69,52.2 27.69,54.36 27.81,54.48 TC1265.4
N$11
  Top 0.406: RLEDOFF.1 LEDOFF.C
N$13
  Top 0.762: S1.P$1 15.99,78.22 LEDOFF.A
N$14
  Bottom 0.254: C6.1 Q1.2 81.03,46.23 78.49,48.77 76.02,48.77 MAX3110.10
N$15
  Bottom 0.762: LED5V.A 56.64,59.57 RLED5V.1
N$16
  Top 0.762: TC1265.6 TC1265.5 34.42,54.48 34.54,54.36 34.54,52.45 RBIAS.1
N$17
  Bottom 0.254: C4.1 82.55,61.85 Q1.1 82.55,53.59 78.99,50.04 76.02,50.04 MAX3110.9
S1-1  (via drill 0.71)
  Top 0.254: v30.73,21.59 29.46,20.32 29.46,18.54 29.72,18.29 30.82,18.29 TXB0101-1.1 31.07,18.29
  Bottom 0.254: MTRCONTR.6 8.69,31.04 7.11,29.46 7.11,21.59 10.16,18.54 27.69,18.54 v30.73,21.59
S1-2  (via drill 0.71)
  Top 0.254: TXB0102-2.1 30.94,33.74 31.75,34.54 v31.75,36.07
  Bottom 0.254: 10.52,25.4 MTRCONTR.8 10.77,25.65 17.78,25.65 19.81,27.69 25.15,27.69 31.75,34.29 v31.75,36.07
S2-1  (via drill 0.71)
  Top 0.254: v35.56,21.59 37.59,21.59 38.1,21.08 38.1,18.43 TXB0101-1.8
  Bottom 0.254: R_ES1.1 36.45,10.54 35.05,11.94 35.05,21.08 v35.56,21.59
S2-1-ES  (via drill 0.71)
  Top 0.254: v18.8,20.07 18.8,12.7 20.07,11.43 24.38,11.43 Q2.1
  Bottom 0.254: MTRCONTR.7 8.99,28.3 8.38,27.69 8.38,22.1 10.41,20.07 v18.8,20.07 | R_ES1.2 27.43,9.4 Q2.1
S2-2  (via drill 0.71)
  Top 0.254: v36.07,36.07 38.1,34.04 38.1,32.91 TXB0102-2.8
  Bottom 0.254: R_ES2.1 36.2,26.54 35.31,27.43 35.31,35.56 35.81,36.07 v36.07,36.07
S2-2-ES
  Bottom 0.254: MTRCONTR.9 17.83,22.81 18.54,22.1 24.64,22.1 Q3.1 28.7,22.35 30.23,23.88 R_ES2.2
SCLK  (via drill 0.71)
  Top 0.254: U$2.5 66.48,39.17 JP_SD.5 | v41.66,43.18 41.66,36.07 43.69,34.04 47.5,34.04 MOD5270.J2[25]
  Bottom 0.254: SONAR.4 3.05,52.83 14.73,52.83 21.34,46.23 39.37,46.23 41.66,43.69 v41.66,43.18 | MAX3110.17 64.39,46.35 59.69,41.66 59.69,37.85 60.2,37.34 65.02,37.34 66.55,38.86 JP_SD.5 66.55,35.05 64.26,32.77 MOD5270.J2[25]
U0_RXD
  Top 0.254: PROG_HEADER.4 37.08,1.52 37.85,0.76 50.04,0.76 50.55,1.27 50.55,4.32 50.04,4.83 MOD5270.J2[3]
U0_TXD
  Top 0.254: MOD5270.J2[4] 45.97,4.83 44.45,3.3 44.45,1.52 44.2,1.27 39.88,1.27 39.62,1.52 PROG_HEADER.5
U1_MCRX
  Top 0.254: MOD5270.J2[21] 47.5,28.96 45.21,28.96 42.16,25.91 42.16,15.24 41.4,14.48 38.25,14.48 TXB0101-1.5
U1_MCTX
  Top 0.254: TXB0101-1.4 29.59,14.61 29.21,14.22 29.21,12.45 29.46,12.19 40.64,12.19 43.18,14.73 43.18,25.15 45.72,27.69 MOD5270.J2[22]
U2_MCRX  (via drill 0.71)
  Top 0.254: MOD5270.J2[41] 47.5,51.82 43.18,51.82 38.1,46.74 38.1,36.58 v38.61,36.07 | v38.1,26.42 38.1,29.06 TXB0102-2.5
  Bottom 0.254: v38.61,36.07 38.61,35.81 37.85,35.81 36.58,34.54 36.58,27.94 v38.1,26.42
U2_MCTX  (via drill 0.71)
  Top 0.254: TXB0102-2.4 29.84,29.08 29.21,28.45 v29.21,27.43 | v34.04,36.07 34.04,43.94 45.72,55.63 MOD5270.J2[44]
  Bottom 0.254: v29.21,27.43 31.5,27.43 32.77,28.7 32.77,34.8 v34.04,36.07
(copper drawn outside any net)
  shapes: Bottom area x2, Top area x1

### Text on the board
tPlace: OFF | ON | 5V_ON | 3.7V | 1k | 1k | IMU | DEPTH | ON | GND | CS | MOSI | SONAR | MISO | SCLK | 3.3V | GND | MTR_CNTRL | GND | MISO | SCLK | MOSI | CS | CD | 3.3V | R2 | 10k | R3 | 10k | C WOLOSCHUK 2011 | BLK/GND | ORG/TXD | YEL/RXD | E_STOP | DEPTH
bPlace: 9 | 6 | 5 | 1 | 39p | C4 | 1k | RLED5V | 1k | R_IRQ | 39p | C6 | 4.7k | R_ES2 | 10K | R1 | 4.7k | R_ES1